# Altium schematic sheet POWER.SchDoc
size A4
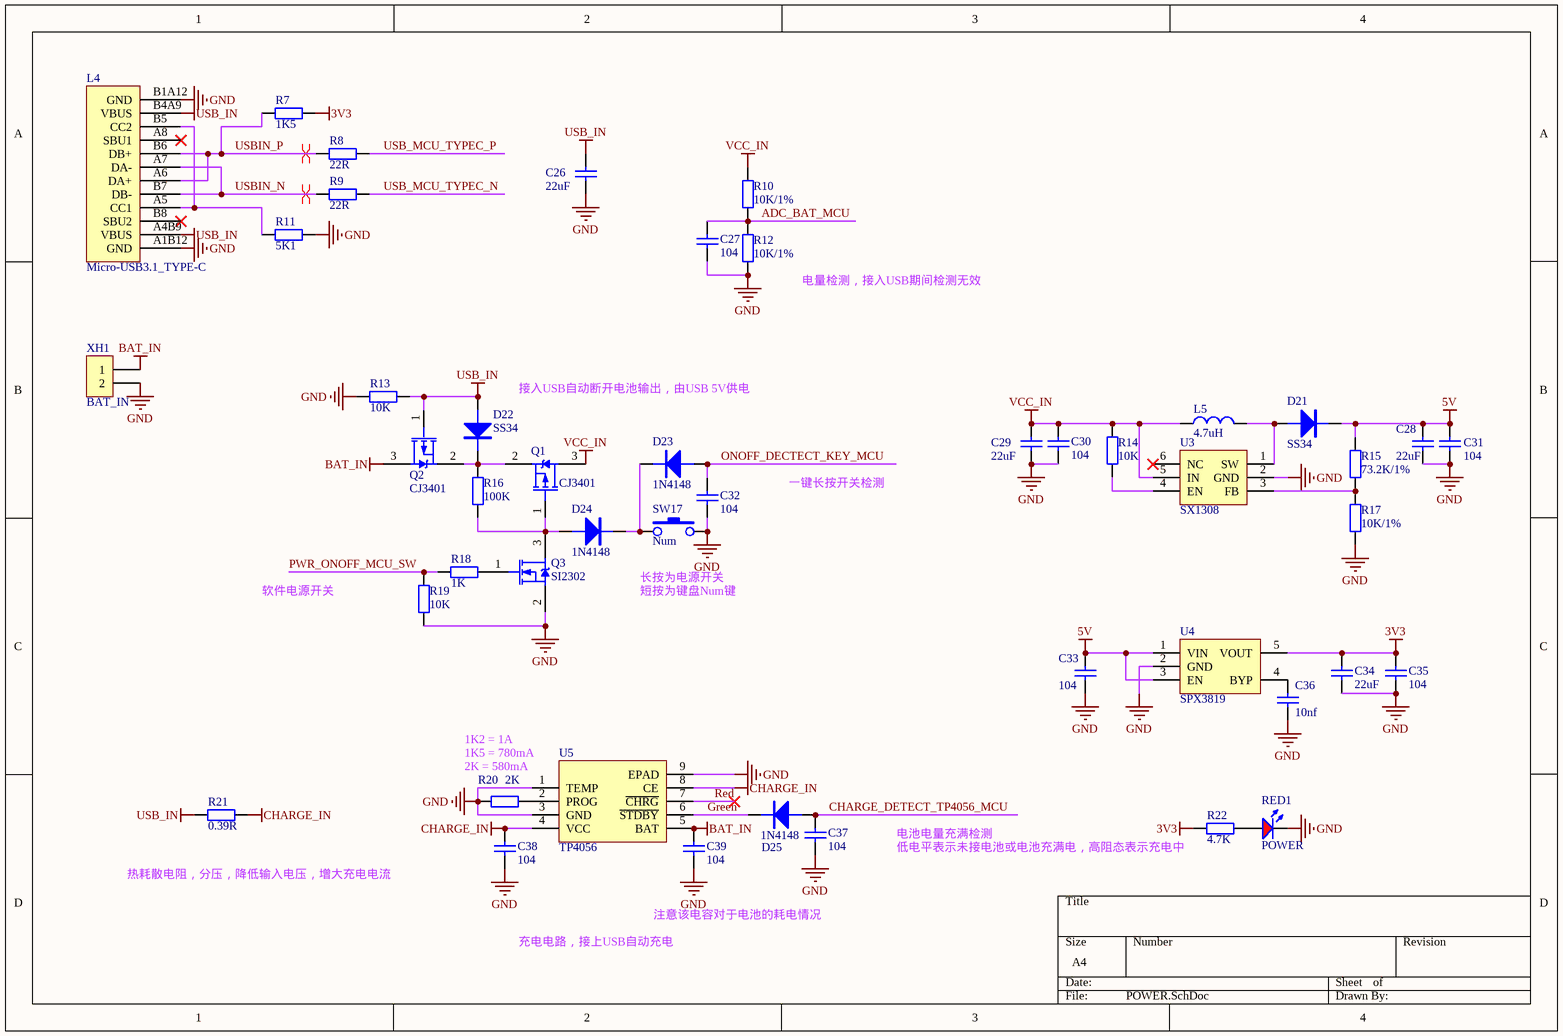
[diagram p0: POWER.SchDoc]

## Parts
C26  22uF  [Cap-0805]
C27  104  [Cap-0603]
C28  22uF  [Cap-0805]
C29  22uF  [Cap-0805]
C30  104  [Cap-0603]
C31  104  [Cap-0603]
C32  104  [Cap-0603]
C33  104  [Cap-0603]
C34  22uF  [Cap-0805]
C35  104  [Cap-0603]
C36  10nf  [Cap-0603]
C37  104  [Cap-0603]
C38  104  [Cap-0603]
C39  104  [Cap-0603]
D21  SS34  [Doide-SMA]
D22  SS34  [Doide-SMA]
D23  1N4148  [SOD-523]
D24  1N4148  [SOD-523]
D25  1N4148  [SOD-523]
L4  Micro-USB3.1_TYPE-C  [USB3.0-TYPEC-12P]
L5  4.7uH  [L-MHC0603]
Q1  CJ3401  [SOT23-3]
Q2  CJ3401  [SOT23-3]
Q3  SI2302  [SOT23-3]
R7  1K5  [Res-0603]
R8  22R  [Res-0603]
R9  22R  [Res-0603]
R10  10K/1%  [Res-0603]
R11  5K1  [Res-0603]
R12  10K/1%  [Res-0603]
R13  10K  [Res-0603]
R14  10K  [Res-0603]
R15  73.2K/1%  [Res-0603]
R16  100K  [Res-0603]
R17  10K/1%  [Res-0603]
R18  1K  [Res-0603]
R19  10K  [Res-0603]
R20  2K  [Res-0603]
R21  0.39R  [Res-1812]
R22  4.7K  [Res-0603]
RED1  POWER  [LED_0603_R]
SW17  Num  [MX_SW-4]
U3  SX1308  [SX1308]
U4  SPX3819  [SOT23-5]
U5  TP4056  [TP4056]
XH1  BAT_IN  [XH2/2.54mm/180]

## Nets
3V3: C34.2 C35.1 R7.1 R22.2 U4.5(VOUT)
5V: C28.2 C31.2 C33.2 D21.K R15.2 U4.1(VIN) U4.3(EN)
BAT_IN: C39.2 Q2.3(D) U5.5(BAT) XH1.1
CHARGE_IN: C38.2 R21.2 U5.4(VCC) U5.8(CE)
GND: C26.1 C27.1 C28.1 C29.1 C30.1 C31.1 C32.2 C33.1 C34.1 C35.2 C36.1 C37.1 C38.1 C39.1 L4.A1B12(GND) L4.B1A12(GND) Q3.2(S) R11.1 R12.1 R13.2 R17.1 R19.2 R20.2 RED1.2(K) SW17.2 U3.2(GND) U4.2(GND) U5.1(TEMP) U5.3(GND) U5.9(EPAD) XH1.2
USB_IN: C26.2 D22.A L4.A4B9(VBUS) L4.B4A9(VBUS) Q2.1(G) R13.1 R21.1
VCC_IN: C29.2 C30.2 L5.2 Q1.3(D) R10.2 R14.1 U3.5(IN)
ADC_BAT_MCU: C27.2 R10.1 R12.2
CHARGE_DETECT_TP4056_MCU: C37.2 D25.A
Green: D25.K U5.6(~{STDBY})
ONOFF_DECTECT_KEY_MCU: C32.1 D23.A
PWR_ONOFF_MCU_SW: R18.1 R19.1
Red: U5.7(~{CHRG})
USB_MCU_TYPEC_N: R9.1
USB_MCU_TYPEC_P: R8.1
USBIN_N: L4.A7(DA-) L4.B7(DB-) R9.2
USBIN_P: L4.A6(DA+) L4.B6(DB+) R7.2 R8.2
NetC36_2: C36.2 U4.4(BYP)
NetD21_A: D21.A L5.1 U3.1(SW)
NetD22_K: D22.K Q1.2(S) Q2.2(S) R16.1
NetD23_K: D23.K D24.K SW17.1
NetD24_A: D24.A Q1.1(G) Q3.3(D) R16.2
NetL4_A5: L4.A5(CC1) L4.B5(CC2) R11.2
NetQ3_1: Q3.1(G) R18.2
NetR14_2: R14.2 U3.4(EN)
NetR15_1: R15.1 R17.2 U3.3(FB)
NetR20_1: R20.1 U5.2(PROG)
NetR22_1: R22.1 RED1.1(A)

Not connected (* = marked no-connect by the designer): L4 A8(SBU1)* B8(SBU2)*; U3 6(NC)*

## Layout directives
differential pair: USBIN_N, USBIN_P

## Notes on the sheet
- 电量检测，接入USB期间检测无效
- 接入USB自动断开电池输出，由USB 5V供电
- 一键长按开关检测
- 长按为电源开关
- 软件电源开关
- 短按为键盘Num键
- 1K2 = 1A
- 1K5 = 780mA
- 2K = 580mA
- 电池电量充满检测
- 低电平表示未接电池或电池充满电，高阻态表示充电中
- 热耗散电阻，分压，降低输入电压，增大充电电流
- 注意该电容对于电池的耗电情况
- 充电电路，接上USB自动充电

## Library data of the parts
C26-C35 C37-C39 = CAP: 贴片陶瓷电容
C36 = Cap
D21-D25 = DIODE: 普通二极管
L5 = INDUCTOR-SMD: 贴片屏蔽电感
Q1 Q2 = MOSFET-P2: P-Channel MOSFET; PackageDocument: 1995/1996; Published: 8-Jun-2000; LatestRevisionDate: 17-Jul-2002; LatestRevisionNote: Re-released for DXP Platform.; PackageReference: E3; Publisher: Altium Limited
Q3 = MOSFET-N2: N-Channel MOSFET; PackageDocument: 1995/1996; Published: 8-Jun-2000; LatestRevisionDate: 17-Jul-2002; LatestRevisionNote: Re-released for DXP Platform.; PackageReference: E3; Publisher: Altium Limited
R7-R22 = RES: 贴片电阻
RED1 = LED_SMD_RED: 发光二极管; ComponentLink1Description: 供应商链接; ComponentLink1URL: http://www.szlcsc.com/product/details_2659.html; Package: 0603; Supplier: LC; SuppliersPartNumber: C2286
SW17 = MX_SW-4: with Fixation pins  1-Pole
XH1 = XH2